# Altium schematic sheet MicroController.SchDoc
size A4; SheetNumber: 3; SheetTotal: 3
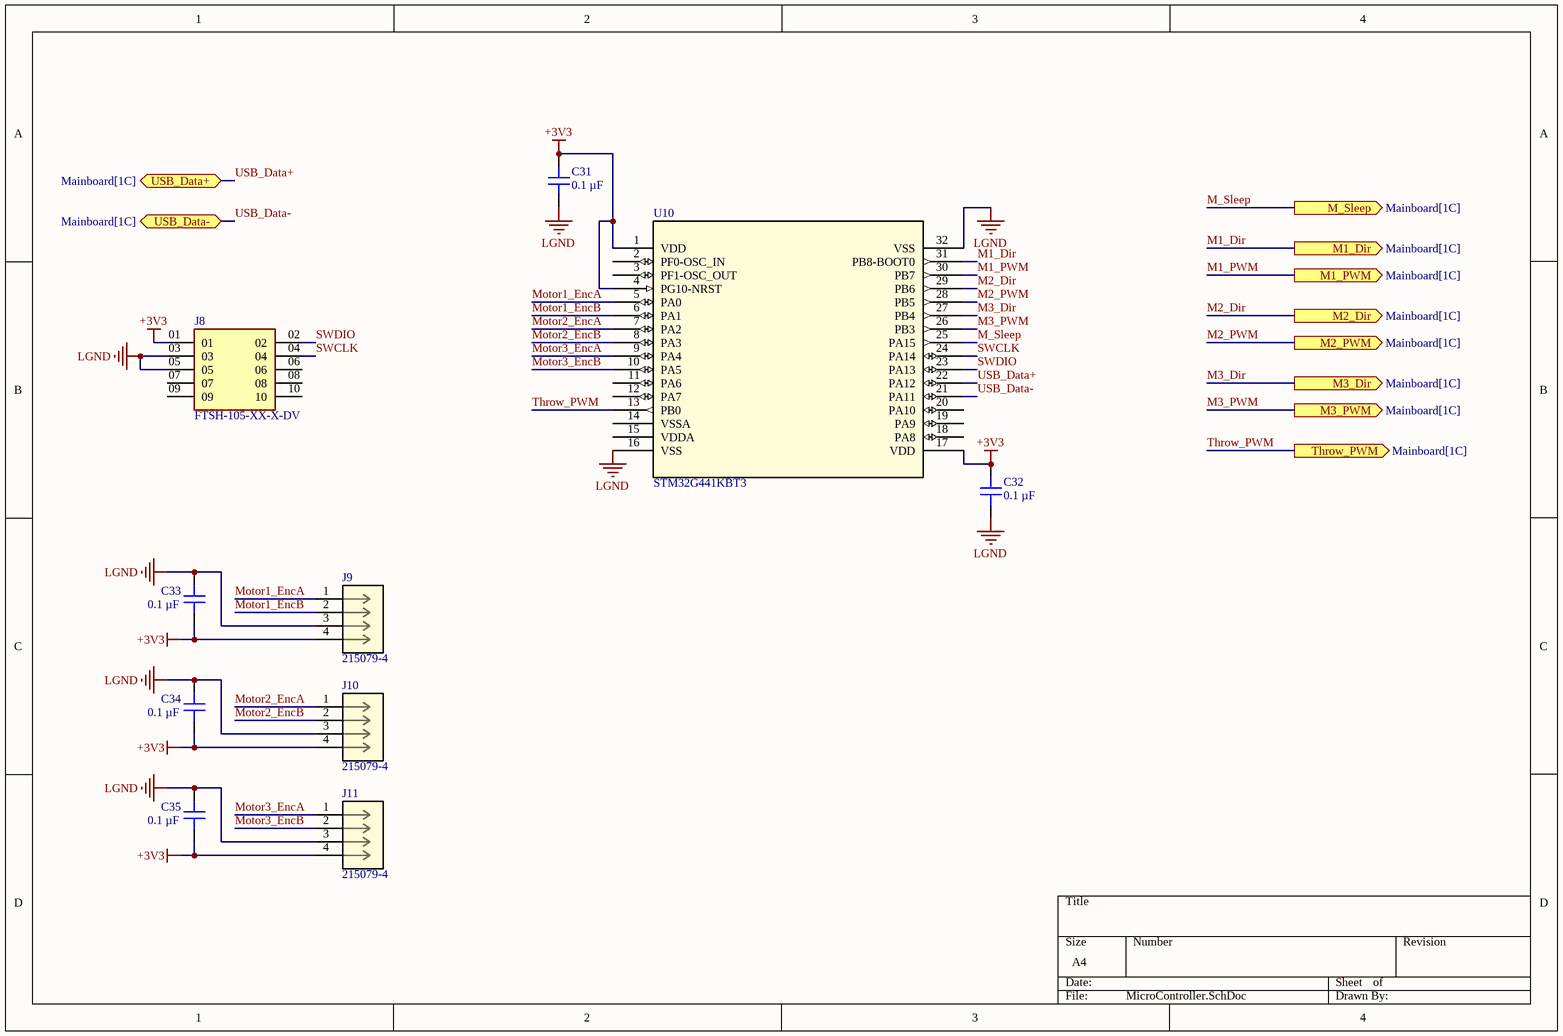
[diagram p0: MicroController.SchDoc]

## Parts
C31  0.1 µF  [CAP 1206_3216 - 0.8MM]
C32  0.1 µF  [CAP 1206_3216 - 0.8MM]
C33  value 0.1 µF  [CAP 1206_3216 - 0.8MM]
C34  value 0.1 µF  [CAP 1206_3216 - 0.8MM]
C35  value 0.1 µF  [CAP 1206_3216 - 0.8MM]
J8  FTSH-105-XX-X-DV  [SAMTEC_FTSH-105-XX-X-DV]
J9  215079-4  [CONN_215079-4_TYC]
J10  215079-4  [CONN_215079-4_TYC]
J11  215079-4  [CONN_215079-4_TYC]
U10  STM32G441KBT3  [LQFP32_7X7_STM]

## Ports
M1_Dir (out, see Mainboard[1C]), M1_PWM (out, see Mainboard[1C]), M2_Dir (out, see Mainboard[1C]), M2_PWM (out, see Mainboard[1C]), M3_Dir (out, see Mainboard[1C]), M3_PWM (out, see Mainboard[1C]), M_Sleep (out, see Mainboard[1C]), Throw_PWM (out, see Mainboard[1C]), USB_Data+ (bidir, see Mainboard[1C]), USB_Data- (bidir, see Mainboard[1C])

## Nets
+3V3: C31.2 C32.2 C33.1 C34.1 C35.1 J8.01 J9.4 J10.4 J11.4 U10.1(VDD) U10.4(PG10-NRST) U10.17(VDD)
LGND: C31.1 C32.1 C33.2 C34.2 C35.2 J8.03 J8.05 J9.3 J10.3 J11.3 U10.16(VSS) U10.32(VSS)
M1_Dir: U10.31(PB8-BOOT0) ; port M1_Dir
M1_PWM: U10.30(PB7) ; port M1_PWM
M2_Dir: U10.29(PB6) ; port M2_Dir
M2_PWM: U10.28(PB5) ; port M2_PWM
M3_Dir: U10.27(PB4) ; port M3_Dir
M3_PWM: U10.26(PB3) ; port M3_PWM
M_Sleep: U10.25(PA15) ; port M_Sleep
Motor1_EncA: J9.1 U10.5(PA0)
Motor1_EncB: J9.2 U10.6(PA1)
Motor2_EncA: J10.1 U10.7(PA2)
Motor2_EncB: J10.2 U10.8(PA3)
Motor3_EncA: J11.1 U10.9(PA4)
Motor3_EncB: J11.2 U10.10(PA5)
SWCLK: J8.04 U10.24(PA14)
SWDIO: J8.02 U10.23(PA13)
Throw_PWM: U10.13(PB0) ; port Throw_PWM
USB_Data+: U10.22(PA12) ; port USB_Data+
USB_Data-: U10.21(PA11) ; port USB_Data-

Not connected (* = marked no-connect by the designer): J8 06 07 08 09 10; U10 2(PF0-OSC_IN) 3(PF1-OSC_OUT) 11(PA6) 12(PA7) 14(VSSA) 15(VDDA) 18(PA8) 19(PA9) 20(PA10)

## Library data of the parts
C31-C35 = CC1206MRY5V9BB104: CAP CER 0.1UF 50V Y5V 1206; manufacturer: Yageo; Temperature Coefficient: Y5V (F); Tolerance: ±20%; Part Number: CC1206MRY5V9BB104; Applications: General Purpose; Capacitance: 0.1 µF; componentlink1description: Datasheet; componentlink1url: http://www.yageo.com/documents/recent/UPY-GPHC_Y5V_6.3V-to-50V_8.pdf; componentlink2description: DigiKey Link; componentlink2url: https://www.digikey.com/en/products/detail/yageo/CC1206MRY5V9BB104/5884674; Device Package: 1206 (3216 Metric); lastupdated: 19.09.2022 13:06:48; Lifecycle Status: Active; Minimum Order: 1; Mounting Type: Surface Mount, MLCC; Operating Temperature: -30°C ~ 85°C; Package / Case: 1206 (3216 Metric); packaging: TapeAndReel; partid: 18711; Part Status: Active; price: 0.05; series: CC; Size / Dimension: 0.126" L x 0.063" W (3.20mm x 1.60mm); Supplier 1: DigiKey; Supplier Part Number 1: 311-4504-1-ND; Thickness (Max): 0.028" (0.70mm); Voltage - Rated: 50V
  C31 C32: Value: 0.1 µF
J8 = CMP-004-000000-1: Connector Header Surface Mount 10 position 0.050" (1.27mm); Design Item ID: FTSH-105-XX-X-DV; Value: *; Availability: Unavailable; MP: FTSH-105-XX-X-DV; Component Type: Standard; Source: FTSH-105-XX-X-DV.SchLib; Package: None; Price: None; Pin Count: 10
J9-J11 = CMP-040-000000-1: No Description Available; Mfr_Name: TE Connectivity; Type: DEV; Copyright: Copyright (C) 2022 Ultra Librarian. All rights reserved.; Pin Count: 4; Source: 215079-4.SchLib; Design Item ID: 215079-4; RefDes: RefDes; Manufacturer_Part_Number: 215079-4; Component Type: Standard
U10 = STM32G441KBT3: No Description Available; Mfr_Name: STMicroelectronics; Copyright: Copyright (C) 2022 Ultra Librarian. All rights reserved.; Manufacturer_Part_Number: STM32G441KBT3; RefDes: RefDes; Type: DEV